# EAGLE board GaN_Fet_ESC_V0.2 (EAGLE 9.6.2), part 1 of 2
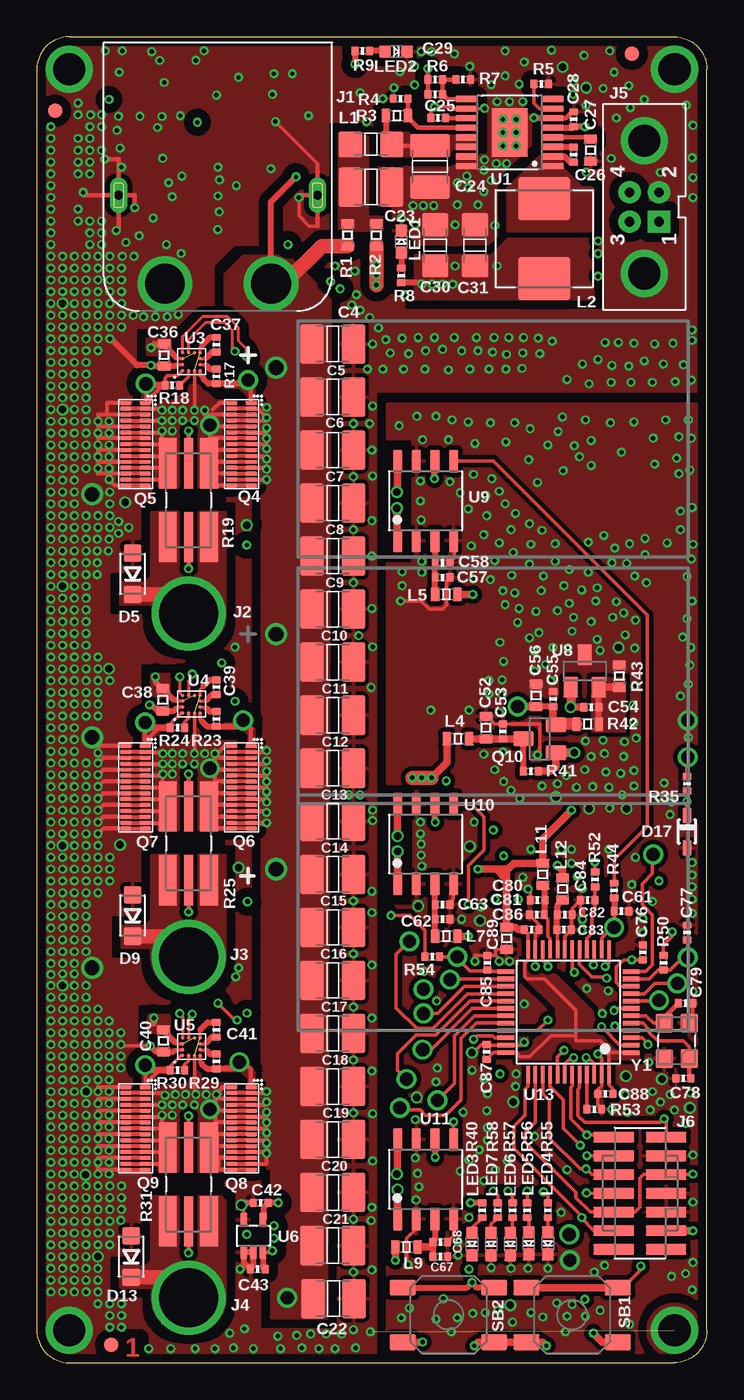
[diagram p4: board, top side]
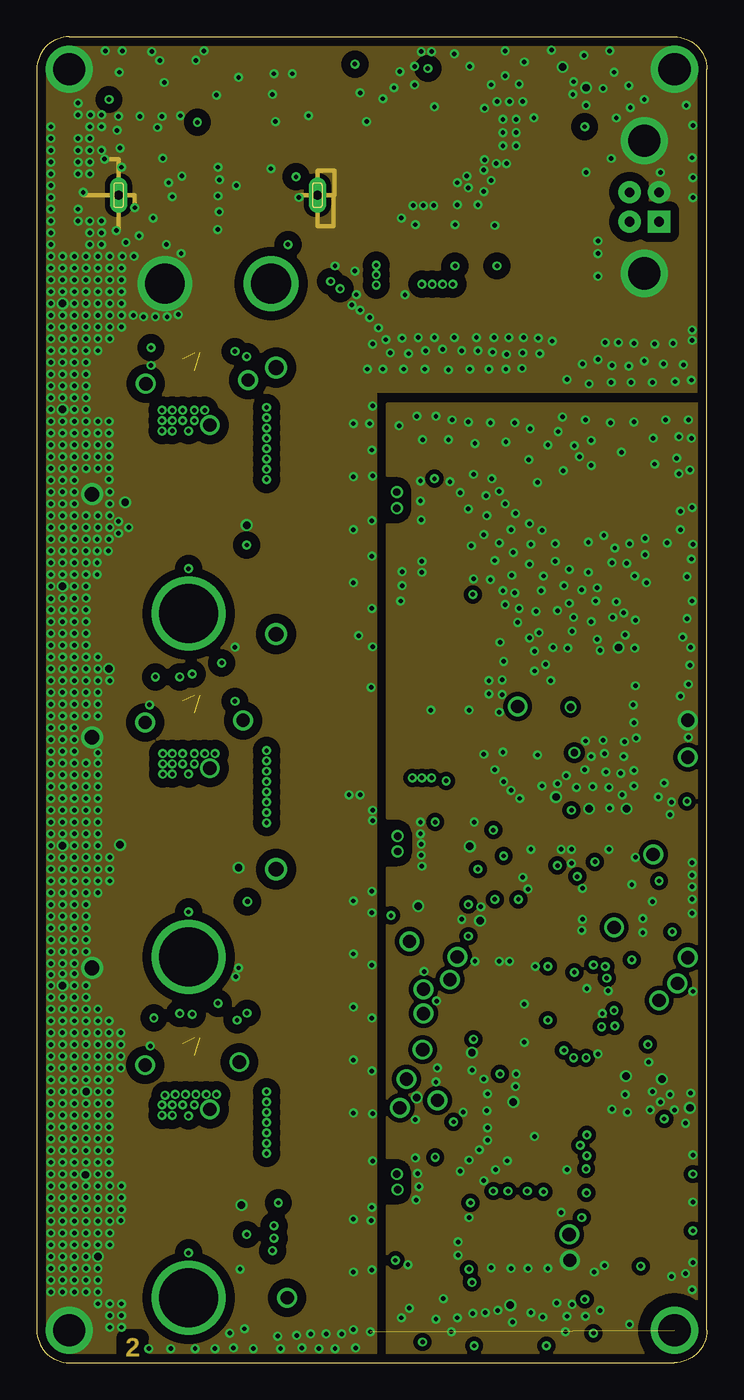
[diagram p5: board, inner layer Route2]
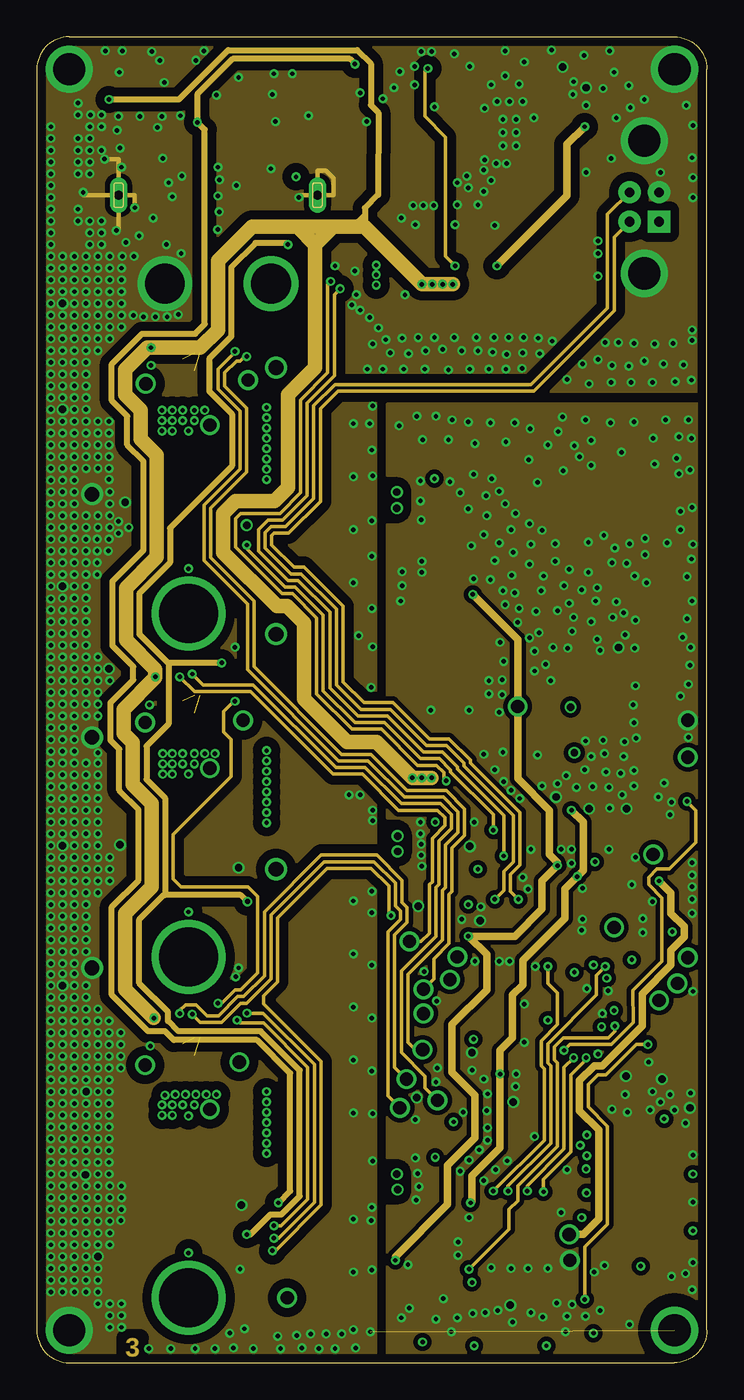
[diagram p6: board, inner layer Route15]
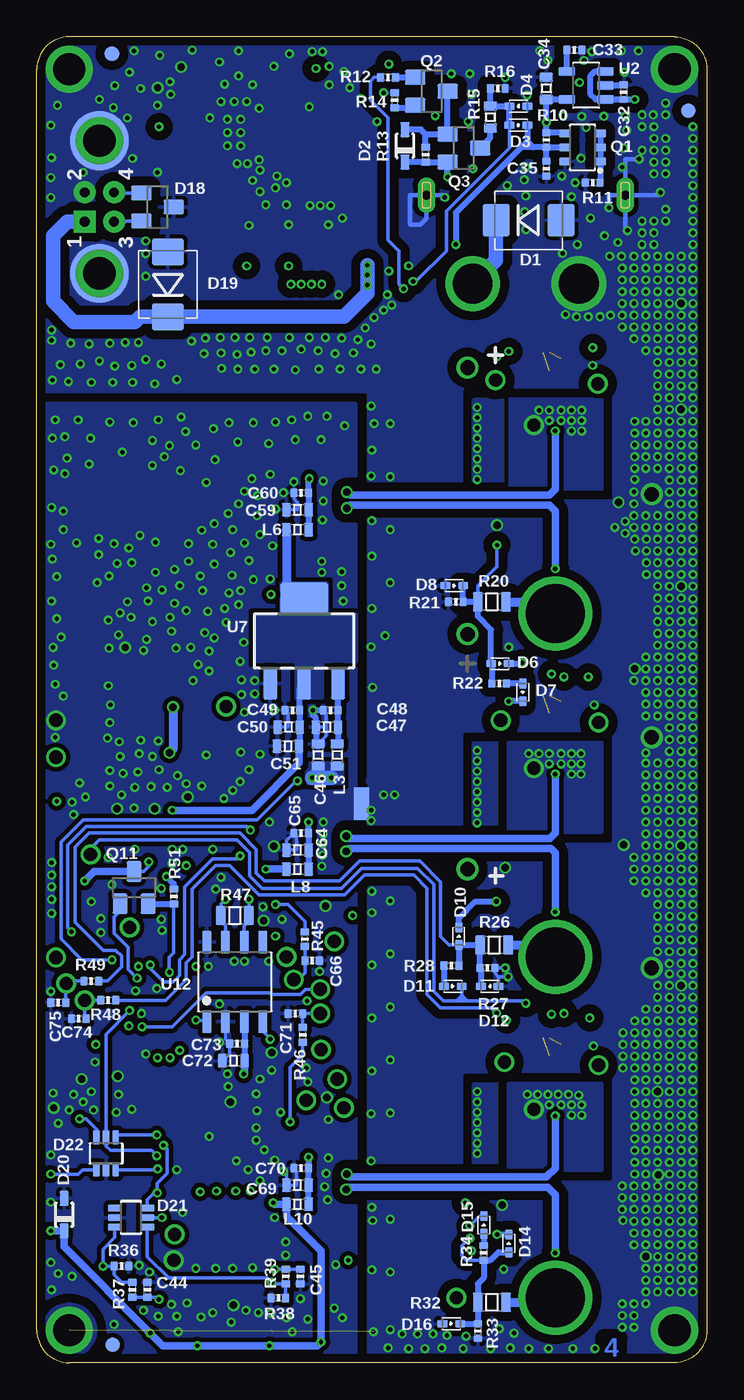
[diagram p7: board, bottom side, seen from below]

Size 45.5 x 90 mm. Coordinates in mm from the lower left corner, seen from the top.
Outline: 45.5,2.2 arc-90 43.3,0 2.2,0 arc-90 0,2.2 0,87.8 arc-90 2.2,90 43.3,90 arc-90 45.5,87.8 45.5,2.2
Copper layers (1+2*15+16): Top 0.035mm / dielectric 0.3mm / Route2 0.035mm / dielectric 0.15mm / Route15 0.035mm / dielectric 0.3mm / Bottom 0.035mm
Design rules "Design_Rules_10_mils_4_layer *": minimum track width 5mil, minimum drill 0.25mm, track to track 0.2mm, track to pad 0.2mm, pad to pad 0.2mm, via to via 0.2mm, smd to smd 0.1mm, copper to edge 0.6mm, drill to drill 12mil, minimum pad ring 6mil, minimum via ring 6mil, stop-mask expansion 0mil, vias tented up to drill 0.6mm, thermal gap 10mil
Net classes: 1 HV: clearance 0.61 mm
tRestrict: 3 lines

## Footprints (pad centres in the part's own frame; a part is rotated, then mirrored left to right if it is on the bottom)
AIM_1_MM = smd 1 x 1: AIM 0,0
BRIDGE = smd 2.2 x 0.508: 1 0,-0.254; 2 0,0.254
C_7.50_16_26.5_4 = drill 1: + 0.5,4.85; - -12,-3.75
C_7.50_16_26.5_6 = drill 1: + 0.5,3.5; - -12,-3.5
C_7.50_16_26.5_5 = drill 1: + 0.5,2.95; - -12,-3.75
C1210 = smd 1.6 x 2.7: 1 -1.4,0; 2 1.4,0
C0402 = smd 0.5 x 0.6: 1 -0.5,0; 2 0.5,0
C0603 = smd 0.6 x 0.9: 1 -0.75,0; 2 0.75,0
C1206 = smd 1.6 x 1.8: 1 -1.4,0; 2 1.4,0
DO214AA(SMB) = smd 1.82 x 2.18: A 2.21,0; K -2.21,0
SOD323F = smd 1 x 0.6: A 1.1,0; C -1.1,0
SOD523 = smd 0.7 x 0.5: A 0.6,0; C -0.6,0
SOD123F = smd 1.2 x 1.2: A 1.4,0; C -1.4,0
SOT23 = smd 1 x 1.4: 1 -0.95,-1.1; 2 0.95,-1.1; 3 0,1.1
SC-70-6 = smd 0.45 x 0.95: 1 0.65,1.1; 2 0,1.1; 3 -0.65,1.1; 4 -0.65,-1.1; 5 0,-1.1; 6 0.65,-1.1
AMASS_XT60PW-M = drill 2.7: 1 -3.6,0; 2 3.6,0 | drill 0.6 pad 1.2 long: 3 -6.75,6; 4 6.75,6
POLYMAX_3.5MM_TH = drill 4: 1 0,0
HARWIN_M80-5000442 = drill 0.65 pad 1.5 square: 1 -1,-1 | drill 0.65 pad 1.5: 2 1,-1; 3 -1,1; 4 1,1 | drill 2.2: 5 -4.5,0; 7 4.5,0 | smd 4 x 4 bottom: 6 -4.5,0; 8 4.5,0
SAMTEC_FTSH-107-01-L-DV-K = smd 2.79 x 0.74: 1 1.778,-3.81; 2 -1.778,-3.81; 3 1.778,-2.54; 4 -1.778,-2.54; 5 1.778,-1.27; 6 -1.778,-1.27; 7 1.778,0; 8 -1.778,0; 9 1.778,1.27; 10 -1.778,1.27; 11 1.778,2.54; 12 -1.778,2.54; 13 1.778,3.81; 14 -1.778,3.81
L1206 = smd 1.6 x 1.8: 1 -1.4,0; 2 1.4,0
WURTH_6.6X6.6 = smd 2.95 x 3.5: 1 -2.725,0; 2 2.725,0
L0603 = smd 0.6 x 0.9: 1 -0.75,0; 2 0.75,0
CHIP-LED0603 = smd 0.8 x 0.8: A 0,-0.75; C 0,0.75
SC-74 = smd 0.8 x 0.55: 1 -1.2,0.95; 2 -1.2,0; 3 -1.2,-0.95; 4 1.2,-0.95; 5 1.2,0; 6 1.2,0.95
EPC2206 = smd 0.27 x 0.79: 1 -2.8,0.665; 2 -2.8,-0.665; 3 -2.4,0.665; 4 -2.4,-0.665; 5 -2,0.665; 6 -2,-0.665; 7 -1.6,0.665; 8 -1.6,-0.665; 9 -1.2,0.665; 10 -1.2,-0.665; 11 -0.8,0.665; 12 -0.8,-0.665; 13 -0.4,0.665; 14 -0.4,-0.665; 15 0,0.665; 16 0,-0.665; 17 0.4,0.665; 18 0.4,-0.665; 19 0.8,0.665; 20 0.8,-0.665; 21 1.2,0.665; 22 1.2,-0.665; 23 1.6,0.665; 24 1.6,-0.665; 25 2,0.665; 26 2,-0.665; 27 2.4,0.665; 28 2.4,-0.665; 29 2.8,0.665; 30 2.8,-0.665
R0603 = smd 0.6 x 0.9: 1 -0.75,0; 2 0.75,0
R0402 = smd 0.5 x 0.6: 1 -0.5,0; 2 0.5,0
CSS2H-2512 = smd 3.4 x 1.2: 1 -2.5,1.4; 2 2.5,1.4; 3 -2.5,-1.4; 4 2.5,-1.4 | smd 3.4 x 0.6: 1_SENSE -2.5,0; 2_SENSE 2.5,0
R0805 = smd 0.7 x 1.3: 1 -0.95,0; 2 0.95,0
EVQQ2U03W = smd 1.8 x 1.1: 1 -3.1,1.85; 1' 3.1,1.85; 2 -3.1,-1.85; 2' 3.1,-1.85
0.5MM = drill 0.5: P$1 0,0
0.9MM = drill 0.9: P$1 0,0
TSS0P16-PAD = smd 0.45 x 1.5: 1 -2.275,-2.9; 2 -1.625,-2.9; 3 -0.975,-2.9; 4 -0.325,-2.9; 5 0.325,-2.9; 6 0.975,-2.9; 7 1.625,-2.9; 8 2.275,-2.9; 9 2.275,2.9; 10 1.625,2.9; 11 0.975,2.9; 12 0.325,2.9; 13 -0.325,2.9; 14 -0.975,2.9; 15 -1.625,2.9; 16 -2.275,2.9 | smd 3.29 x 2.41: PAD 0,0
SOT-23-5 = smd 1.1 x 0.6: 1 -1.3,0.95; 2 -1.3,0; 3 -1.3,-0.95; 4 1.3,-0.95; 5 1.3,0.95
LMG1205 = smd 0.24 x 0.24: 1A -0.6,-0.6; 1B -0.2,-0.6; 1C 0.2,-0.6; 1D 0.6,-0.6; 2A -0.6,-0.2; 2D 0.6,-0.2; 3A -0.6,0.2; 3D 0.6,0.2; 4A -0.6,0.6; 4B -0.2,0.6; 4C 0.2,0.6; 4D 0.6,0.6
SC-70-5 = smd 0.45 x 0.95: 1 0.65,1.1; 2 0,1.1; 3 -0.65,1.1; 4 -0.65,-1.1; 5 0.65,-1.1
SOT223 = smd 0.95 x 2.15: 1 -2.3,-2.9; 2 0,-2.9; 3 2.3,-2.9 | smd 3.25 x 2.15: 4 0,2.9
SOIC-8 = smd 1.55 x 0.6: 1 -2.7,1.905; 2 -2.7,0.635; 3 -2.7,-0.635; 4 -2.7,-1.905; 5 2.7,-1.905; 6 2.7,-0.635; 7 2.7,0.635; 8 2.7,1.905
LQFP-48 = smd 0.3 x 1.2: 1 -2.75,-4.25; 2 -2.25,-4.25; 3 -1.75,-4.25; 4 -1.25,-4.25; 5 -0.75,-4.25; 6 -0.25,-4.25; 7 0.25,-4.25; 8 0.75,-4.25; 9 1.25,-4.25; 10 1.75,-4.25; 11 2.25,-4.25; 12 2.75,-4.25; 25 2.75,4.25; 26 2.25,4.25; 27 1.75,4.25; 28 1.25,4.25; 29 0.75,4.25; 30 0.25,4.25; 31 -0.25,4.25; 32 -0.75,4.25; 33 -1.25,4.25; 34 -1.75,4.25; 35 -2.25,4.25; 36 -2.75,4.25 | smd 1.2 x 0.3: 13 4.25,-2.75; 14 4.25,-2.25; 15 4.25,-1.75; 16 4.25,-1.25; 17 4.25,-0.75; 18 4.25,-0.25; 19 4.25,0.25; 20 4.25,0.75; 21 4.25,1.25; 22 4.25,1.75; 23 4.25,2.25; 24 4.25,2.75; 37 -4.25,2.75; 38 -4.25,2.25; 39 -4.25,1.75; 40 -4.25,1.25; 41 -4.25,0.75; 42 -4.25,0.25; 43 -4.25,-0.25; 44 -4.25,-0.75; 45 -4.25,-1.25; 46 -4.25,-1.75; 47 -4.25,-2.25; 48 -4.25,-2.75
CRYSTAL_SMD_3.2X2.5MM = smd 1.3 x 1.2: 1 -1.2,-0.85; 2 1.2,-0.85; 3 1.2,0.85; 4 -1.2,0.85

## Placement (x,y rotation side)
AIM1  [AIM_1_MM]  5.05,1.2 0 top
AIM2  [AIM_1_MM]  1.25,85 0 top
AIM3  [AIM_1_MM]  40.4,88.85 90 top
AIM4  [AIM_1_MM]  40.35,1.2 0 bottom
AIM5  [AIM_1_MM]  40.4,88.85 0 bottom
AIM6  [AIM_1_MM]  1.25,85 0 bottom
BRIDGE1  BRIDGE  [BRIDGE]  23.45,37.95 270 bottom
C1  680uF 80V  [C_7.50_16_26.5_4]  15.75,62.7 0 top
C2  680uF 80V  [C_7.50_16_26.5_6]  15.75,45.95 0 top
C3  680uF 80V  [C_7.50_16_26.5_5]  15.75,30.55 0 top
C4  4.7uF 100V  [C1210]  20.1,69.15 0 top
C5  4.7uF 100V  [C1210]  20.1,65.55 0 top
C6  4.7uF 100V  [C1210]  20.1,61.95 0 top
C7  4.7uF 100V  [C1210]  20.1,58.35 0 top
C8  4.7uF 100V  [C1210]  20.1,54.75 0 top
C9  4.7uF 100V  [C1210]  20.1,51.15 0 top
C10  4.7uF 100V  [C1210]  20.1,47.55 0 top
C11  4.7uF 100V  [C1210]  20.1,43.95 0 top
C12  4.7uF 100V  [C1210]  20.1,40.35 0 top
C13  4.7uF 100V  [C1210]  20.1,36.75 0 top
C14  4.7uF 100V  [C1210]  20.1,33.15 0 top
C15  4.7uF 100V  [C1210]  20.1,29.55 0 top
C16  4.7uF 100V  [C1210]  20.1,25.95 0 top
C17  4.7uF 100V  [C1210]  20.1,22.35 0 top
C18  4.7uF 100V  [C1210]  20.1,18.75 0 top
C19  4.7uF 100V  [C1210]  20.1,15.15 0 top
C20  4.7uF 100V  [C1210]  20.1,11.55 0 top
C21  4.7uF 100V  [C1210]  20.1,7.95 0 top
C22  4.7uF 100V  [C1210]  20.15,4.35 0 top
C23  4.7uF 100V  [C1210]  22.7,79.8 0 top
C24  4.7uF 100V  [C1210]  26.7,81.2 270 top
C25  10nF 10V  [C0402]  27.25,84.5 180 top
C26  1uF 10V  [C0402]  36.45,82 90 top
C27  10uF 10V  [C0603]  37.6,82.3 270 top
C28  1uF 10V  [C0402]  36.45,84.4 90 top
C29  47pF C0G 5%  [C0402]  27.05,87.1 0 top
C30  47uF 10V  [C1206]  27.05,75.85 90 top
C31  47uF 10V  [C1206]  29.75,75.85 90 top
C32  1uF 10V  [C0402]  5.65,86.25 90 bottom
C33  10nF 10V  [C0402]  9,89.1 0 bottom
C34  10uF 10V  [C0603]  10.9,86.5 90 bottom
C35  0.1uF 10V  [C0402]  10.9,81.05 270 bottom
C36  10uF 10V  [C0603]  8.65,68.4 270 top
C37  1uF 10V  [C0402]  12.2,69.1 90 top
C38  10uF 10V  [C0603]  8.55,45 270 top
C39  1uF 10V  [C0402]  12.2,45.85 90 top
C40  10uF 10V  [C0603]  8.6,21.85 270 top
C41  1uF 10V  [C0402]  12.2,22.6 90 top
C42  0.1uF 10V  [C0402]  15.2,10.85 180 top
C43  0.1uF 10V  [C0402]  15,6.35 180 top
C44  0.1uF 10V  [C0402]  38,4.95 90 bottom
C45  0.1uF 10V  [C0402]  27.6,5.85 270 bottom
C46  10uF 10V  [C0603]  26.4,41.25 90 bottom
C47  10uF 10V  [C0603]  25.8,43.15 180 bottom
C48  0.1uF 10V  [C0402]  25.55,44.3 180 bottom
C49  0.1uF 10V  [C0402]  28.15,44.3 180 bottom
C50  10uF 10V  [C0603]  28.4,43.15 180 bottom
C51  10uF 10V  [C0603]  28.45,41.85 180 bottom
C52  10uF 10V  [C0603]  30.5,43.1 90 top
C53  0.1uF 10V  [C0402]  31.65,42.85 90 top
C54  100pF C0G 5%  [C0402]  37.65,44.5 0 top
C55  0.1uF 10V  [C0402]  35.05,45.05 90 top
C56  10uF 10V  [C0603]  33.9,45.3 90 top
C57  1uF 10V  [C0402]  27.55,53.3 0 top
C58  0.1uF 10V  [C0402]  27.55,54.3 0 top
C59  10uF 10V  [C0603]  27.8,57.9 180 bottom
C60  0.1uF 10V  [C0402]  27.55,59.05 180 bottom
C61  0.1uF 10V  [C0402]  39.7,30.65 0 top
C62  1uF 10V  [C0402]  27.55,30.1 0 top
C63  0.1uF 10V  [C0402]  27.55,31.1 0 top
C64  10uF 10V  [C0603]  27.8,34.8 180 bottom
C65  0.1uF 10V  [C0402]  27.55,35.95 180 bottom
C66  10nF 10V  [C0402]  26.8,27.3 0 bottom
C67  1uF 10V  [C0402]  27.4,7.2 0 top
C68  0.1uF 10V  [C0402]  27.4,8.2 0 top
C69  10uF 10V  [C0603]  27.8,12.05 180 bottom
C70  0.1uF 10V  [C0402]  27.55,13.2 180 bottom
C71  10nF 10V  [C0402]  27.95,23.7 180 bottom
C72  10uF 10V  [C0603]  32.15,20.5 180 bottom
C73  0.1uF 10V  [C0402]  31.9,21.65 180 bottom
C74  10nF 10V  [C0402]  42.65,23.35 180 bottom
C75  10nF 10V  [C0402]  44.05,24.45 180 bottom
C76  0.1uF 10V  [C0402]  41.15,27.85 90 top
C77  10nF 10V  [C0402]  44.15,29.2 90 top
C78  18pF C0G 5%  [C0402]  43.9,19.3 0 top
C79  18pF C0G 5%  [C0402]  44.05,24.4 180 top
C80  1uF 10V  [C0402]  34,31.4 180 top
C81  0.1uF 10V  [C0402]  33.95,30.4 180 top
C82  1uF 10V  [C0402]  35.85,30.4 0 top
C83  0.1uF 10V  [C0402]  35.8,29.4 0 top
C84  10nF 10V  [C0402]  37.4,31.4 180 top
C85  0.1uF 10V  [C0402]  30.6,27.15 90 top
C86  0.1uF 10V  [C0402]  33.6,29.4 0 top
C87  0.1uF 10V  [C0402]  30.55,21.1 90 top
C88  0.1uF 10V  [C0402]  38.6,18.25 180 top
C89  10uF 10V  [C0603]  31.9,28.8 270 top
D1  SMBJ60A  [DO214AA(SMB)]  12.1,77.55 0 bottom
D2  N/A  [SOD323F]  20.5,82.6 90 bottom
D3  BAS16  [SOD523]  12.8,84 180 bottom
D4  BAS16  [SOD523]  12.8,85.3 0 bottom
D5  PMEG10010ELR  [SOD123F]  6.5,53.55 90 top
D6  BAS16  [SOD523]  14.05,47.45 180 bottom
D7  BAT54  [SOD523]  12.5,45.5 90 bottom
D8  N/A  [SOD523]  17.15,52.75 180 bottom
D9  PMEG10010ELR  [SOD123F]  6.5,30.35 90 top
D10  BAS16  [SOD523]  16.85,28.95 270 bottom
D11  BAT54  [SOD523]  17.25,25.55 180 bottom
D12  N/A  [SOD523]  14.75,25.55 0 bottom
D13  PMEG10010ELR  [SOD123F]  6.4,7.2 90 top
D14  BAS16  [SOD523]  13.45,8.1 270 bottom
D15  BAT54  [SOD523]  15.15,9.35 270 bottom
D16  N/A  [SOD523]  17.35,2.65 180 bottom
D17  MM3Z3V3  [SOD323F]  44.15,36.05 270 top
D18  PESD2CAN  [SOT23]  37.3,78.45 270 bottom
D19  SMBJ60A  [DO214AA(SMB)]  36.6,73.2 90 bottom
D20  PESD3V3U1UA  [SOD323F]  43.65,10.05 90 bottom
D21  PESD5V0L5U  [SC-70-6]  39.1,9.85 90 bottom
D22  PESD5V0L5U  [SC-70-6]  40.8,14.2 180 bottom
J1  AMASS_XT60PW-M  [AMASS_XT60PW-M]  12.3,73.25 0 top
J2  POLYMAX_3.5MM/TH  [POLYMAX_3.5MM_TH]  10.3,50.85 90 top
J3  POLYMAX_3.5MM/TH  [POLYMAX_3.5MM_TH]  10.3,27.55 90 top
J4  POLYMAX_3.5MM/TH  [POLYMAX_3.5MM_TH]  10.3,4.4 90 top
J5  HARWIN_M80-5000442  [HARWIN_M80-5000442]  41.25,78.45 90 top
J6  SAMTEC_FTSH-107-01-L-DV-K  [SAMTEC_FTSH-107-01-L-DV-K]  40.95,11.5 0 top
L1  120R  [L1206]  22.7,82.7 0 top
L2  15uH 2.75A  [WURTH_6.6X6.6]  34.45,76.3 270 top
L3  470R  [L0603]  25.1,41.25 270 bottom
L4  470R  [L0603]  28.6,42.35 180 top
L5  470R  [L0603]  27.8,52.15 0 top
L6  470R  [L0603]  27.8,56.55 0 bottom
L7  470R  [L0603]  27.8,28.95 0 top
L8  470R  [L0603]  27.8,33.5 0 bottom
L9  470R  [L0603]  25.1,7.85 180 top
L10  470R  [L0603]  27.8,10.75 0 bottom
L11  470R  [L0603]  34.35,33.15 270 top
L12  470R  [L0603]  35.7,32.15 270 top
LED1  green  [CHIP-LED0603]  24.75,76.1 0 top
LED2  green  [CHIP-LED0603]  24.4,89 270 top
LED3  green  [CHIP-LED0603]  29.55,8.05 180 top
LED4  yellow  [CHIP-LED0603]  34.7,8.1 180 top
LED5  white  [CHIP-LED0603]  33.4,8.1 180 top
LED6  blue  [CHIP-LED0603]  32.15,8.05 180 top
LED7  red  [CHIP-LED0603]  30.85,8.05 180 top
LOGO1  LOGO  [LOGO]  39.75,61.8 0 bottom
LOGO2  LOGO  [LOGO]  39.75,61.8 0 top
Q1  BCM53DS  [SC-74]  8.45,82.5 180 bottom
Q2  MMBT5550L  [SOT23]  18.7,86.3 270 bottom
Q3  SI2337DS-T1-BE3  [SOT23]  16.5,82.45 270 bottom
Q4  EPC2206  [EPC2206]  13.9,62.35 270 top
Q5  EPC2206  [EPC2206]  6.7,62.35 270 top
Q6  EPC2206  [EPC2206]  13.9,39.05 270 top
Q7  EPC2206  [EPC2206]  6.7,39.05 270 top
Q8  EPC2206  [EPC2206]  13.9,15.9 270 top
Q9  EPC2206  [EPC2206]  6.7,15.9 270 top
Q10  MMBT5550L  [SOT23]  34.15,42.35 90 top
Q11  SI2337DS-T1-BE3  [SOT23]  38.9,32.25 0 bottom
R1  N/A  [R0603]  21.1,76.55 90 top
R2  0R  [R0603]  23.05,76.55 90 top
R3  0R  [R0603]  24.45,84.65 180 top
R4  N/A  [R0402]  24.7,85.8 0 top
R5  N/A  [R0402]  34.25,86.8 180 top
R6  1M 1%  [R0402]  27.05,86.1 180 top
R7  249k 1%  [R0402]  28.95,87.1 180 top
R8  10k 1%  [R0402]  24.75,73.8 270 top
R9  3.3k 5%  [R0402]  22.1,89.05 180 top
R10  10k 1%  [R0402]  10.9,83 90 bottom
R11  1k 5%  [R0402]  7.75,80.1 0 bottom
R12  1k 5%  [R0402]  21.65,87.25 0 bottom
R13  10k 1%  [R0402]  19.1,82 270 bottom
R14  3.3k 5%  [R0402]  21.2,85.7 270 bottom
R15  174k 75V 1%  [R0603]  14.7,84.55 270 bottom
R16  10k 1%  [R0402]  14.2,86.5 180 bottom
R17  0R  [R0402]  12.2,66.95 270 top
R18  0R  [R0402]  9.2,66.35 180 top
R19  0.75m 1%  [CSS2H-2512]  10.3,58.55 270 top
R20  10k 0.5W 75V 5%  [R0805]  14.6,51.65 180 bottom
R21  N/A  [R0402]  17.05,51.65 0 bottom
R22  3.3k 5%  [R0402]  14.1,46.1 0 bottom
R23  0R  [R0402]  12.2,43.7 270 top
R24  0R  [R0402]  9.55,43.1 180 top
R25  0.75m 1%  [CSS2H-2512]  10.3,35.25 270 top
R26  10k 0.5W 75V 5%  [R0805]  14.45,28.35 180 bottom
R27  N/A  [R0402]  14.9,26.8 180 bottom
R28  3.3k 5%  [R0402]  17.35,26.95 180 bottom
R29  0R  [R0402]  12.2,20.45 270 top
R30  0R  [R0402]  9.55,19.85 180 top
R31  0.75m 1%  [CSS2H-2512]  10.3,12.1 270 top
R32  10k 0.5W 75V 5%  [R0805]  14.6,4.1 180 bottom
R33  N/A  [R0402]  15.55,2.15 90 bottom
R34  3.3k 5%  [R0402]  15.15,7.45 90 bottom
R35  1k 5%  [R0402]  44.15,39.3 90 top
R36  10k 1%  [R0402]  39.75,6.55 180 bottom
R37  180R 5%  [R0402]  39,4.95 90 bottom
R38  10k 1%  [R0402]  29.1,4.4 0 bottom
R39  180R 5%  [R0402]  28.6,5.85 270 bottom
R40  3.3k 5%  [R0402]  30.25,10.35 90 top
R41  180R 5%  [R0402]  33.55,40.15 180 top
R42  10k 0.5%  [R0603]  37.4,43.35 180 top
R43  33k 0.5%  [R0603]  39.55,46.6 270 top
R44  10k 1%  [R0402]  39.2,32.05 270 top
R45  10R 5%  [R0402]  27.3,28.75 270 bottom
R46  10R 5%  [R0402]  27.45,22.25 270 bottom
R47  120R 0.25W 1%  [R0805]  32.05,30.35 180 bottom
R48  10R 5%  [R0402]  40.65,24.6 180 bottom
R49  10R 5%  [R0402]  41.8,25.9 180 bottom
R50  10R 5%  [R0402]  42.55,27.15 270 top
R51  1k 1%  [R0402]  36.2,31.65 90 bottom
R52  10R 5%  [R0402]  37.9,32.8 270 top
R53  10k 1%  [R0402]  37.85,17.2 180 top
R54  10k 1%  [R0402]  26.85,27.55 0 top
R55  3.3k 5%  [R0402]  34.7,10.35 90 top
R56  1k 5%  [R0402]  33.3,10.35 90 top
R57  1k 5%  [R0402]  32.3,10.35 90 top
R58  3.3k 5%  [R0402]  31.3,10.35 90 top
SB1  EVQQ2U03W  [EVQQ2U03W]  36.35,3.25 0 top
SB2  EVQQ2U03W  [EVQQ2U03W]  27.95,3.25 0 top
TP1  [0.5MM]  14.25,56.85 0 top
TP2  [0.5MM]  13.9,10.7 0 top
TP3  [0.5MM]  4.15,7.2 0 top
TP4  [0.5MM]  6,58.4 90 top
TP5  [0.5MM]  4.9,47.1 90 top
TP6  [0.5MM]  1.75,64.7 0 top
TP7  [0.5MM]  1.75,52.7 90 top
TP8  [0.5MM]  3.35,18.4 90 top
TP9  [0.5MM]  5.65,35.15 90 top
TP10  [0.5MM]  13.7,33.6 90 top
TP11  [0.5MM]  1.75,71.9 90 top
TP12  [0.5MM]  3.3,12.75 90 top
TP13  [0.5MM]  1.75,35.1 90 top
TP14  [0.5MM]  35.7,87.95 270 top
TP15  [0.5MM]  1.75,25.6 90 bottom
TP16  [0.5MM]  37.3,86.55 270 top
TP17  [0.9MM]  17,4.4 0 top
TP18  [0.9MM]  14.35,66.7 0 top
TP19  [0.9MM]  7.4,66.45 0 top
TP20  [0.9MM]  11.75,63.65 0 top
TP21  [0.9MM]  14,43.6 0 top
TP22  [0.9MM]  7.35,43.45 0 top
TP23  [0.9MM]  11.75,40.35 0 top
TP24  [0.9MM]  13.75,20.4 0 top
TP25  [0.9MM]  7.35,20.2 0 top
TP26  [0.9MM]  11.75,17.2 0 top
TP27  [0.5MM]  32.15,3.9 270 top
TP28  [0.5MM]  44.35,17.3 0 top
TP29  [0.5MM]  42.45,19.25 0 top
TP30  [0.5MM]  40,19.45 0 top
TP31  [0.5MM]  40.05,37.6 0 top
TP32  [0.5MM]  37.5,37.6 0 top
TP33  [0.5MM]  35.25,38.4 0 top
TP34  [0.5MM]  32.35,17.7 0 top
TP35  [0.5MM]  30.1,30 0 top
TP36  [0.5MM]  29.55,21.05 0 top
TP37  [0.5MM]  29.4,35.05 0 top
TP38  [0.5MM]  39.5,48.55 0 top
TP39  [0.5MM]  25.8,18 0 top
TP40  [0.5MM]  25.9,31 90 top
TP41  [0.9MM]  44.2,43.6 90 top
TP42  [0.9MM]  44.2,41.1 90 top
TP43  [0.9MM]  32.65,44.55 0 top
TP45  [0.9MM]  43.5,25.75 90 bottom
TP46  [0.9MM]  42.25,24.6 0 top
TP47  [0.9MM]  28.05,26 0 top
TP48  [0.9MM]  39.2,29.55 0 top
TP49  [0.9MM]  44.2,27.5 0 top
TP50  [0.9MM]  41.85,34.5 0 top
TP51  [0.9MM]  28.55,27.55 270 bottom
TP52  [0.9MM]  24.65,17.3 0 top
TP53  [0.9MM]  27.2,17.8 0 top
TP54  [0.9MM]  26.2,21.25 0 top
TP55  [0.9MM]  25.1,19.25 0 top
TP56  [0.9MM]  25.3,28.6 0 top
TP57  [0.9MM]  26.25,25.35 0 top
TP58  [0.9MM]  26.25,23.7 0 top
TP59  [0.9MM]  36.15,8.7 0 top
TP60  [0.9MM]  36.2,6.95 0 top
U1  LM46002  [TSS0P16-PAD]  32.1,83.5 90 top
U2  LP2985-3.3  [SOT-23-5]  8.2,86.7 180 bottom
U3  LMG1205  [LMG1205]  10.5,67.95 0 top
U4  LMG1205  [LMG1205]  10.5,44.7 0 top
U5  LMG1205  [LMG1205]  10.5,21.45 0 top
U6  MCP9700A  [SC-70-5]  14.7,8.6 180 top
U7  ADP3338AKCZ-3.3  [SOT223]  27.35,49 0 bottom
U8  TL1431ACL3T  [SOT23]  37.2,46.95 0 top
U9  INA240A2  [SOIC-8]  26.4,58.5 90 top
U10  INA240A2  [SOIC-8]  26.4,35.2 90 top
U11  INA240A2  [SOIC-8]  26.4,12.45 90 top
U12  SN65HVD232  [SOIC-8]  32.05,25.85 90 bottom
U13  STM32G473CET6  [LQFP-48]  36.1,23.8 90 top
Y1  16Mhz 12pF  [CRYSTAL_SMD_3.2X2.5MM]  43.45,21.85 90 top